# EAGLE schematic untitled (EAGLE 8.0.1)
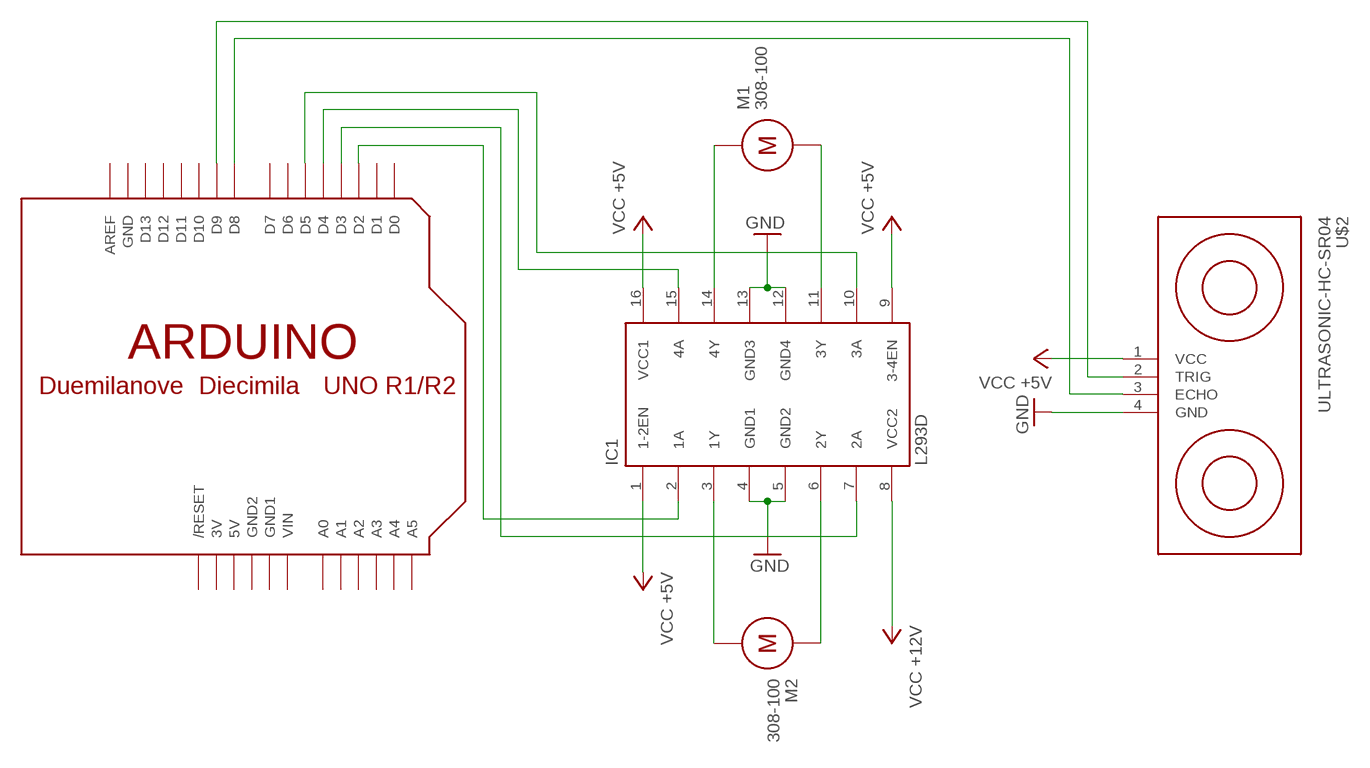
[diagram p0: schematic, sheet 1]

## Parts
IC1  L293D  [DIL16]
M1  308-100  [308-100]
M2  308-100  [308-100]
U$1  ARDUINOUNO  [ARDUINO]
U$2  ULTRASONIC-HC-SR04  [ULTRASONIC-HC-SR04]

## Nets
GND: IC1.4(GND1) IC1.5(GND2) IC1.12(GND4) IC1.13(GND3) U$2.4(GND)
N$3: IC1.3(1Y) M2.NEG
N$4: IC1.6(2Y) M2.POS
N$5: IC1.11(3Y) M1.NEG
N$6: IC1.14(4Y) M1.POS
N$7: U$1.D8 U$2.3(ECHO)
N$8: U$1.D9 U$2.2(TRIG)
N$9: IC1.2(1A) U$1.D2
N$10: IC1.7(2A) U$1.D3
N$11: IC1.15(4A) U$1.D4
N$12: IC1.10(3A) U$1.D5
VCC: IC1.1(1-2EN) IC1.8(VCC2) IC1.9(3-4EN) IC1.16(VCC1) U$2.1(VCC) ; supply symbol labelled VCC +5V, VCC +12V
Unconnected: U$1.A0 U$1.A1 U$1.A2 U$1.A3 U$1.A4 U$1.A5 U$1.AREF U$1.D0 U$1.D1 U$1.D6 U$1.D7 U$1.D10 U$1.D11 U$1.D12 U$1.D13 U$1.RESET(/RESET)

## Power pins joined to a net without a drawn wire
3V: U$1.3V
5V: U$1.5V
GND: U$1.GND
GND1: U$1.GND1
GND2: U$1.GND2
VIN: U$1.VIN

## Library data of the parts
IC1 = st-microelectronics:L293D: PUSH-PULL 4 CHANNEL DRIVER; MPN: L293D; OC_FARNELL: 9589619; OC_NEWARK: 56P8249
M1 M2 = motor:308-100: Pico Vibe 8mm Vibration Motor - 3mm Type; PRECISION_MICRODRIVES: 308-100
U$1 = adafruit:ARDUINO: Arduino Diecimila/Duemilanove Make a shield with ease, this package has all the named pins as well as the two mounting drill holes and an outline of the USB and DC power connector. The outline is on the DIMENSION layer, so if your board house uses it they will cut the outline to match. http://www.ladyada.net/library/pcb/eaglelibrary.html
U$2 = diy-modules:ULTRASONIC-HC-SR04: Ultrasonic Ranging Module HC-SR04 More details available here: http://randomnerdtutorials.com/complete-guide-for-ultrasonic-sensor-hc-sr04/ Click here to find device on ebay.com <http://www.ebay.com/sch/hc+sr04+ultrasonic>